# EAGLE schematic airu-schematic (EAGLE 7.1.0)
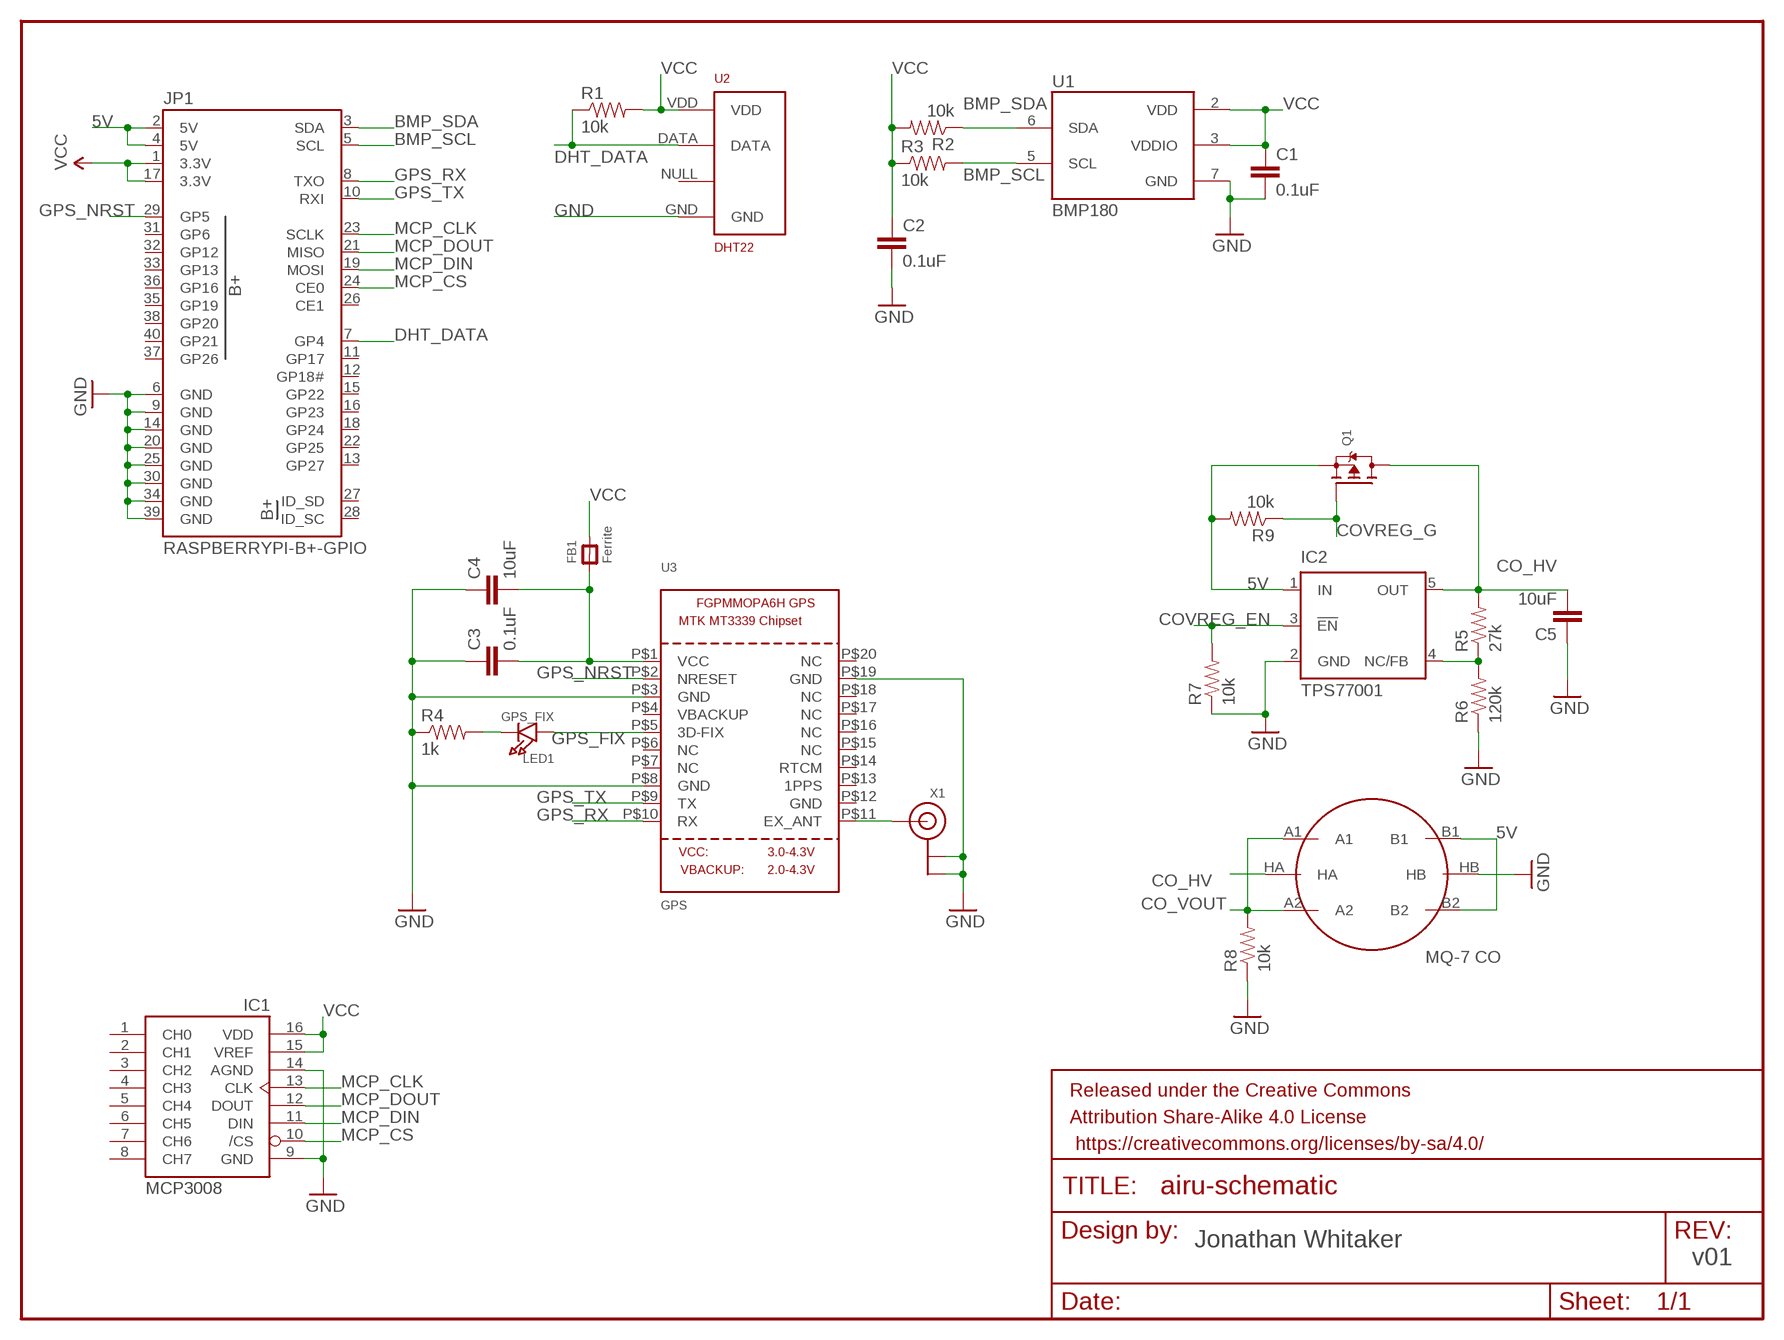
[diagram p0: schematic, sheet 1]

## Parts
C1  0.1uF  CAP1206  [1206]
C2  0.1uF  CAP1206  [1206]
C3  0.1uF  CAP1206  [1206]
C4  10uF  CAP1206  [1206]
C5  10uF  CAP1206  [1206]
FB1  Ferrite  FERRITE0805  [0805]
FRAME1  FRAME-LETTER  [CREATIVE_COMMONS]
IC1  MCP3008  [DIL16]
IC2  TPS77001  [SOT23-DBV]
JP1  RASPBERRYPI-B+-GPIO  [2X20-SHROUDED]
LED1  GPS_FIX  LED1206  [CHIPLED_1206]
Q1  MOSFET-P  [SOT23-R]
R1  10k  RESISTOR1206  [1206]
R2  10k  RESISTOR1206  [1206]
R3  10k  RESISTOR1206  [1206]
R4  1k  RESISTOR1206  [1206]
R5  27k  RESISTOR1206  [1206]
R6  120k  RESISTOR1206  [1206]
R7  10k  RESISTOR1206  [1206]
R8  10k  RESISTOR1206  [1206]
R9  10k  RESISTOR1206  [1206]
U1  BMP180  [BMP180]
U2  DHT22  RHT03_DHT-22_AM2302  [RHT03_DHT-22]
U3  GPS  GPS_FGPMMOPA6H  [FGPMMOPA6H]
U$1  METHANE_SENSOR  [MQ-3]
X1  ANTENNA_U.FL  [U.FL]

## Nets
5V: IC2.1(IN) JP1.2(5V) JP1.4(5V) Q1.2(S) R9.2 U$1.B1 U$1.B2
BMP_SCL: JP1.5(SCL) R3.2 U1.5(SCL)
BMP_SDA: JP1.3(SDA) R2.1 U1.6(SDA)
CO_HV: C5.2 IC2.5(OUT) Q1.3(D) R5.2 U$1.HA
CO_VOUT: R8.2 U$1.A1 U$1.A2
COVREG_EN: IC2.3(!EN) R7.2
COVREG_G: Q1.1(G) R9.1
DHT_DATA: JP1.7(GP4) R1.1 U2.DATA
GND: C1.2 C2.2 C3.1 C4.1 C5.1 IC1.9(GND) IC1.14(AGND) IC2.2(GND) JP1.6(GND) JP1.9(GND) JP1.14(GND) JP1.20(GND) JP1.25(GND) JP1.30(GND) JP1.34(GND) JP1.39(GND) R4.1 R6.1 R7.1 R8.1 U1.7(GND) U2.GND U3.P$3(GND) U3.P$8(GND) U3.P$19(GND) U$1.HB X1.1(GND) X1.2(GND)
GPS_FIX: LED1.A U3.P$5(3D-FIX)
GPS_NRST: JP1.29(GP5) U3.P$2(NRESET)
GPS_RX: JP1.8(TXO) U3.P$10(RX)
GPS_TX: JP1.10(RXI) U3.P$9(TX)
MCP_CLK: IC1.13(CLK) JP1.23(SCLK)
MCP_CS: IC1.10(/CS) JP1.24(CE0)
MCP_DIN: IC1.11(DIN) JP1.19(MOSI)
MCP_DOUT: IC1.12(DOUT) JP1.21(MISO)
N$1: C3.2 C4.2 FB1.1 U3.P$1(VCC)
N$2: U3.P$11(EX_ANT) X1.3(SIGNAL)
N$3: LED1.C R4.2
N$5: IC2.4(NC/FB) R5.1 R6.2
VCC: C1.1 C2.1 FB1.2 IC1.15(VREF) IC1.16(VDD) JP1.1(3.3V) JP1.17(3.3V) R1.2 R2.2 R3.1 U1.2(VDD) U1.3(VDDIO) U2.VDD
Unconnected: IC1.1(CH0) IC1.2(CH1) IC1.3(CH2) IC1.4(CH3) IC1.5(CH4) IC1.6(CH5) IC1.7(CH6) IC1.8(CH7) JP1.11(GP17) JP1.12(GP18#) JP1.13(GP27) JP1.15(GP22) JP1.16(GP23) JP1.18(GP24) JP1.22(GP25) JP1.26(CE1) JP1.27(ID_SD) JP1.28(ID_SC) JP1.31(GP6) JP1.32(GP12) JP1.33(GP13) JP1.35(GP19) JP1.36(GP16) JP1.37(GP26) JP1.38(GP20) JP1.40(GP21) U2.NULL U3.P$4(VBACKUP) U3.P$6(NC) U3.P$7(NC) U3.P$12(GND) U3.P$13(1PPS) U3.P$14(RTCM) U3.P$15(NC) U3.P$16(NC) U3.P$17(NC) U3.P$18(NC) U3.P$20(NC)

## Notes on the sheet
- MQ-7 CO

## Library data of the parts
C1-C5 = SparkFun-Passives:CAP: Capacitor Standard 0603 ceramic capacitor, and 0.1" leaded capacitor.
FB1 = microbuilder:FERRITE: Ferrite Bead 0603 MMZ1608B121C - 120 Ohm @ 100MHz, 600mA, 0.15 Ohm DC Resistance - Digikey: 445-2164-1-ND BK1608HW121-T - 120 Ohm, 600mA Ferrite Chip - Digikey: 587-1876-2-ND 0805 HZ0805B272R-10 - 2.7K Ohm @ 100MHz, 200mA, 0.8 Ohm DC Resistance - Digikey: 240-2504-1-ND (see also Murata BLM21BD272SN1L) MMZ2012Y152B - 1.5K Ohm @ 100MHz, 500mA, 0.4 Ohm DC Resistance - Digikey: 445-1560-1-ND - Mainly for high frequency (80-400MHz) MMZ2012R102A - 1K Ohm @ 100MHz, 500mA, 0.3 Ohm DC Resistance - Digikey: 445-1555-2-ND - More general purpose (10-200MHz)
FRAME1 = SparkFun-Aesthetics:FRAME-LETTER: Schematic Frame Standard 8.5x11 US Letter frame; DESIGNER: Jonathan Whitaker; VERSION: v01
IC1 = adafruit:MCP3008
IC2 = texas:TPS770*: ULTRALOW-POWER 50-mA LOW-DROPOUT LINEAR REGULATORS 50-mA Low-Dropout Regulator Source: http://focus.ti.com/lit/ds/symlink/tps77001.pdf; MF: TEXAS INSTRUMENTS; MPN: TPS77001DBVT; OC_FARNELL: 8461554; OC_NEWARK: 77C1171
JP1 = SparkFun-Boards:RASPBERRYPI-B+-GPIO: Raspberry Pi B+ GPIO Header 2x20 pin connector
LED1 = microbuilder:LED: LED 0603 - 0603 Surface Mount Package 2mA: Green LED - Low Power (3.9mcd, 2ma, 1.7Vf) - Digikey: 475-2709-2-ND Orange LED - Low Power (9.8mcd, 2ma, 1.8Vf) - Digikey: 475-1194-2-ND Red LED - Low Power (5mcd, 2ma, 1.8Vf) - Digikey: 475-1195-2-ND Yellow LED - Low Power (7mcd, 2ma, 1.8Vf) - Digikey: 475-1196-2-ND 5mA: Blue LED - Low Power (17mcd, 5ma, 2.9Vf) - Digikey: LNJ937W8CRACT-ND 0805 - 0805 Surface Mount Package 2mA: Red LED (8.8mcd, 2mA, 1.8Vf, Clear) - Low Power [Digikey: 475-2510-1-ND] Green LED (5mcd, 2mA, 1.8Vf, Clear) - Low Power [Digikey: 475-2730-1-ND] Yellow LED (11.3mcd, 2mA, 1.8Vf, Clear) - Low Power [Digikey: 475-2555-1-ND] 20mA: Red LED (104mcd, 20mA, Diffused) - LS R976 [Digikey: 475-1278-6-ND] Red LED (12mcd, 20mA, 2.0Vf, Clear) - APT2012EC [Digikey: 754-1128-1-ND] Green LED (15mcd, 20mA, 2.2Vf, Clear) - APT2012GC [Digikey: 754-1131-1-ND] Orange LED (160mcd, 20mA, 2.1Vf, Clear) - APT2012SECK [Digikey: 754-1130-1-ND] 1206 - 1206 Surface Mount Package Green LED (26mcd, 20mA, Diffused) - LG N971 [Digikey: 475-1407-6-ND] Red LED (15mcd, 20mA, Diffused) - LH N974 [Digikey: 475-1416-6-ND]
Q1 = microbuilder:MOSFET-P: P-Channel Mosfet LEGEND VDS: Voltage Drain-Source ID: Drain Current RDS(ON): Drain-Source On-State Resistance VGS(TH): Gate-Source Threshold Voltage CISS: Drain-Source Input Capacitance SOT-23 Name VDS ID RDS(ON) VGS(TH) CISS Order Number IRLML5103 30V 760mA 600 mOhm -- 75pF @ 25V Digikey: IRLML5103PBFCT-ND IRLML6401 12V 4.3A 50 mOhm 950mV @ 250µA 830pF @ 10V Digikey: IRLML6401PBFTR-ND NTR0202PL 20V 400mA 800 mOhm 2.3V @ 250uA 70pF @ 5V Digikey: NTR0202PLT1GOSTR-ND NTR4101PT1G 20V 1.8A 85 mOhm 1.2V @ 250uA 675pF @ 10V Digikey: NTR4101PT1GOSCT-ND DMP2004K 20V 600mA 900 mOhm 1V @ 250uA 175pF @ 16V Digikey: DMP2004KDICT-ND PMV65XP 20V 3.9A 76 mOhm 950mV @ 1mA 725pF @ 20V Digikey: 568-2358-2-ND TO-252 Name VDS ID RDS(ON) VGS(TH) CISS Order Number AOD417 30V 25A 34 mOhm 3V @ 250µA 920pF @ 15V Digikey: 785-1106-2-ND
R1-R9 = SparkFun-Passives:RESISTOR: Resistor Basic schematic elements and footprints for 0603, 1206, and PTH resistors.
U1 = SparkFun-Sensors:BMP180: BOSCH BMP180 DIGITAL BAROMETRIC PRESSURE SENSOR Web page: http://www.bosch-sensortec.com/en/homepage/products_3/environmental_sensors_1/bmp180_1/bmp180 Datasheet: http://ae-bst.resource.bosch.com/media/products/dokumente/bmp180/BST-BMP180-DS000-09.pdf The BMP180 is the function compatible successor of the BMP085, a new generation of high precision digital pressure sensors for consumer applications. The ultra-low power, low voltage electronics of the BMP180 is optimized for use in mobile phones, PDAs, GPS navigation devices and outdoor equipment. With a low altitude noise of merely 0.25m at fast conversion time, the BMP180 offers superior performance. The I2C interface allows for easy system integration with a microcontroller. The BMP180 is based on piezo-resistive technology for EMC robustness, high accuracy and linearity as well as long term stability. Key features: - Temperature measurement included - I2C interface - Fully calibrated - Pb-free, halogen-free and RoHS compliant, - MSL 1 Basic specs: Pressure range: 300 to 1100hPa (+9000m to -500m relating to sea level) Supply voltage: 1.8 to 3.6V (VDD), 1.62V to 3.6V (VDDIO) Package: LGA package with metal lid Small footprint: 3.6mm x 3.8mm Super-flat: 0.93mm height Low power: 5μA at 1 sample / sec. in standard mode Low noise: 0.06hPa (0.5m) in ultra low power mode, 0.02hPa (0.17m) advanced resolution mode Typical applications: - Enhancement of GPS navigation (dead-reckoning, slope detection, etc.) - In- and out-door navigation - Leisure and sports - Weather forecast - Vertical velocity indication (rise/sink speed)
U2 = RHT03_DHT-22_AM2302:RHT03_DHT-22_AM2302: RHT03 / DHT-22 / AM2302 Packages and symbol for the RHT03 / DHT-22 relative humidity and temperature sensor. Note: The AM2302 is a wired version of the DHT-22 which typically requires less clearance and is thus provided as a separate package.; PROD_ID: SEN-10167
U3 = adafruit:GPS_FGPMMOPA6H: GPS Module - MTK MT3339 Chipset, -165dBm sensitivity, 22 channels, 10Hz, auto-select external antenna options
U$1 = SparkFun-Sensors:METHANE_SENSOR: MQ-4 Methane Gas Sensor SEN-09404
X1 = adafruit:ANTENNA_U.FL: U.FL Antenna Connector